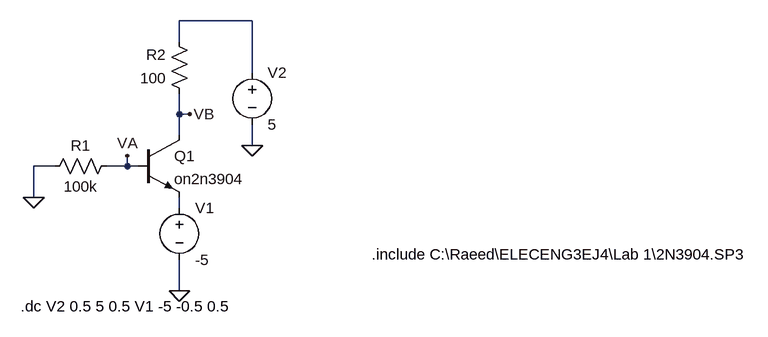
[diagram p0: schematic Part1.asc]
Part1.asc, the LTspice schematic file:
Version 4
SHEET 1 1200 680
WIRE 400 -128 288 -128
WIRE 288 -96 288 -128
WIRE 400 -48 400 -128
WIRE 288 16 288 -16
WIRE 304 16 288 16
WIRE 288 48 288 16
WIRE 400 64 400 32
WIRE 96 96 64 96
WIRE 208 96 208 80
WIRE 208 96 176 96
WIRE 224 96 208 96
WIRE 64 144 64 96
WIRE 288 160 288 144
WIRE 288 288 288 240
FLAG 400 64 0
FLAG 288 288 0
FLAG 64 144 0
FLAG 304 16 VB
FLAG 208 80 VA
SYMBOL res 192 80 R90
WINDOW 0 0 56 VBottom 2
WINDOW 3 32 56 VTop 2
SYMATTR InstName R1
SYMATTR Value 100k
SYMBOL res 304 0 R180
WINDOW 0 36 76 Left 2
WINDOW 3 36 40 Left 2
SYMATTR InstName R2
SYMATTR Value 100
SYMBOL voltage 288 144 R0
WINDOW 123 0 0 Left 0
WINDOW 39 0 0 Left 0
SYMATTR InstName V1
SYMATTR Value -5
SYMBOL voltage 400 -64 R0
WINDOW 123 0 0 Left 0
WINDOW 39 0 0 Left 0
SYMATTR InstName V2
SYMATTR Value 5
SYMBOL npn 224 48 R0
SYMATTR InstName Q1
SYMATTR Value on2n3904
TEXT 44 312 Left 2 !.dc V2 0.5 5 0.5 V1 -5 -0.5 0.5
TEXT 584 232 Left 2 !.include C:\\Raeed\\ELECENG3EJ4\\Lab 1\\2N3904.SP3

The netlist it stands for:
* Part1.asc
R1 VA 0 100k
R2 VB N001 100
V1 N002 0 -5
V2 N001 0 5
Q1 VB VA N002 0 on2n3904
.model NPN NPN
.model PNP PNP
.lib standard.bjt
.dc V2 0.5 5 0.5 V1 -5 -0.5 0.5
.include C:\Raeed\ELECENG3EJ4\Lab 1\2N3904.SP3
.backanno
.end